# Altium schematic sheet 3_shkb_lite_kbd.SchDoc: =ProjectTitle
size A4; Address1: github.com/4pplet/SHKB; Address2: Licence: CERN-OHL-S; SheetNumber: 3; SheetTotal: 3
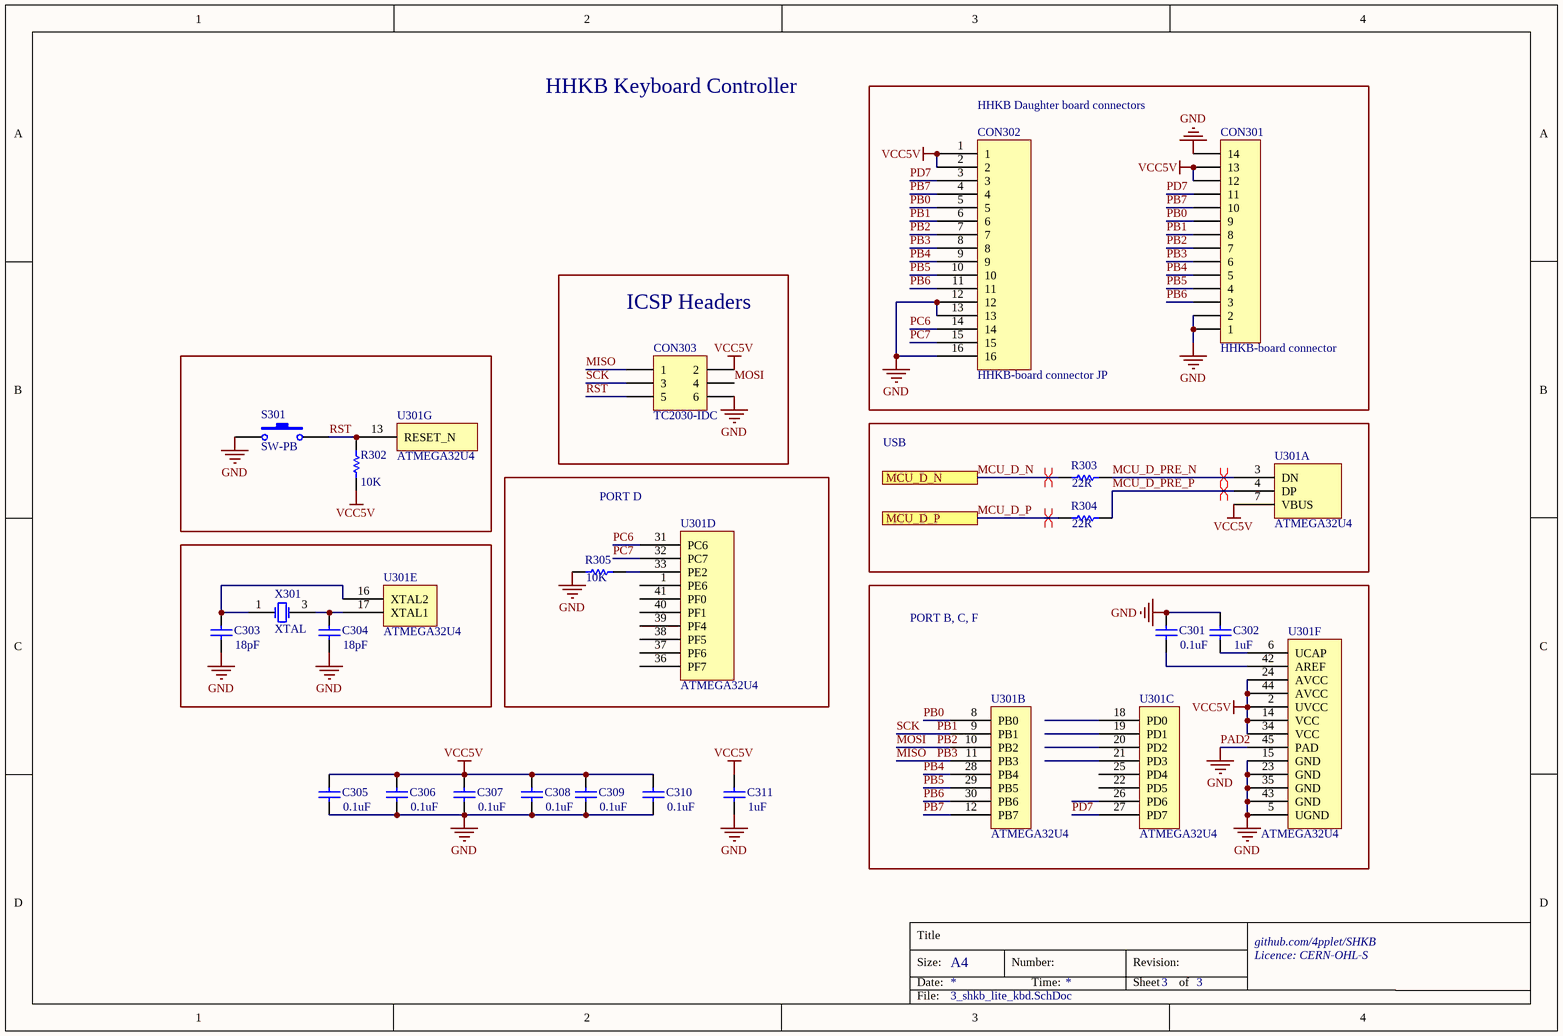
[diagram p0: 3_shkb_lite_kbd.SchDoc]

## Parts
C301  value 0.1uF  [C0603[1608]]
C302  value 1uF  [C0603[1608]]
C303  value 18pF  [C0603[1608]]
C304  value 18pF  [C0603[1608]]
C305  value 0.1uF  [C0603[1608]]
C306  value 0.1uF  [C0603[1608]]
C307  value 0.1uF  [C0603[1608]]
C308  value 0.1uF  [C0603[1608]]
C309  value 0.1uF  [C0603[1608]]
C310  value 0.1uF  [C0603[1608]]
C311  value 1uF  [C0603[1608]]
CON301  HHKB-board connector  [JST S13B-ZR-SM4A-TF(LF)(SN)]
CON302  HHKB-board connector JP  [DF14A-15P-1.25H]  (no BOM)
CON303  TC2030-IDC  [TC2030-IDC-NL]  (no BOM)
R302  value 10K  [R0603[1608]]
R303  value 22R  [R0603[1608]]
R304  value 22R  [R0603[1608]]
R305  value 10K  [R0603[1608]]
S301  SW-PB  [Wurth 431256038736]
U301  ATMEGA32U4  [ATMEGA32U4-COMBO]  (parts A,B,C,D,E,F,G of 7)
X301  XTAL  [XTAL-3225]

## Blocks framed on the sheet
HHKB Daughter board connectors: CON301 CON302
ICSP Headers: CON303
USB: R303 R304 U301
PORT D: R305 U301
PORT B, C, F: C301 C302 U301

## Ports
MCU_D_N, MCU_D_P

## Nets
PAD2: C301.2 C302.2 C303.1 C304.1 C305.1 C306.1 C307.1 C308.1 C309.1 C310.1 C311.1 CON301.1 CON301.2 CON301.14 CON302.12 CON302.13 CON302.16 CON303.6 R305.1 S301.2 S301.3(GND) U301.5(UGND) U301.15(GND) U301.23(GND) U301.35(GND) U301.43(GND) U301.45(PAD) X301.2(GND) X301.4(GND)  [also labelled GND]
VCC5V: C305.2 C306.2 C307.2 C308.2 C309.2 C310.2 C311.2 CON301.12 CON301.13 CON302.1 CON302.2 CON303.2 R302.2 U301.2(UVCC) U301.7(VBUS) U301.14(VCC) U301.24(AVCC) U301.34(VCC) U301.44(AVCC)
MCU_D_N: R303.1 ; port MCU_D_N
MCU_D_P: R304.1 ; port MCU_D_P
MCU_D_PRE_N: R303.2 U301.3(DN)
MCU_D_PRE_P: R304.2 U301.4(DP)
MISO: CON301.6 CON302.8 CON303.1 U301.11(PB3)  [also labelled PB3]
MOSI: CON301.7 CON302.7 CON303.4 U301.10(PB2)  [also labelled PB2]
PB0: CON301.9 CON302.5 U301.8(PB0)
PB1: CON301.8 CON302.6 CON303.3 U301.9(PB1)  [also labelled SCK]
PB4: CON301.5 CON302.9 U301.28(PB4)
PB5: CON301.4 CON302.10 U301.29(PB5)
PB6: CON301.3 CON302.11 U301.30(PB6)
PB7: CON301.10 CON302.4 U301.12(PB7)
PC6: CON302.14 U301.31(PC6)
PC7: CON302.15 U301.32(PC7)
PD7: CON301.11 CON302.3 U301.27(PD7)
RST: CON303.5 R302.1 S301.1 U301.13(RESET_N)
NetC301_1: C301.1 U301.42(AREF)
NetC302_1: C302.1 U301.6(UCAP)
NetC303_2: C303.2 U301.16(XTAL2) X301.1(OSC1)
NetC304_2: C304.2 U301.17(XTAL1) X301.3(OSC2)
NetR305_2: R305.2 U301.33(PE2)

Not connected (* = marked no-connect by the designer): U301 1(PE6) 18(PD0) 19(PD1) 20(PD2) 21(PD3) 22(PD5) 25(PD4) 26(PD6) 36(PF7) 37(PF6) 38(PF5) 39(PF4) 40(PF1) 41(PF0)

## Layout directives
differential pair: MCU_D_N, MCU_D_P, MCU_D_PRE_N, MCU_D_PRE_P

## Notes on the sheet
- HHKB Keyboard Controller
- Title
- Size:
- Date:
- A4
- Number:
- Time:
- Revision:
- Sheet
- of
- File:

## Library data of the parts
C301 C305-C310 = Cap: Capacitor; MRF.Part: CC0603KRX7R9BB104; MFG: KEMET; MFGPN: C0603C104M5RACTU; LCSC MFG: YAGEO; Version: 0603 imperial; JLC: BASIC; LCSC Part #: C14663
C302 C311 = Cap: Capacitor; MRF.Part: CL10A105KB8NNNC; MFG: KEMET; MFGPN: C0603C105K4RACTU; LCSC MFG: Samsung Electro-Mechanics; Version: 0603 imperial; JLC: BASIC; LCSC Part #: C15849
C303 C304 = Cap: Capacitor; MRF.Part: CL10C180JB8NNNC; MFG: KEMET; MFGPN: C0603C180J5GACAUTO; LCSC MFG: Samsung Electro-Mechanics; Version: 0603 imperial; JLC: BASIC; LCSC Part #: C1647
CON301 = Header 14: MFGPN: S13B-ZR-SM4A-TF(LF)(SN); MFG: JST Sales America Inc; LCSC MFG: JST Sales America; JLC: NONE; LCSC Part #: C265326; MRF.Part: S13B-ZR-SM4A-TF(LF)(SN)
CON302 = DF14A-15P-1.25H: MFG: Hirose Electric Co Ltd; MFGPN: DF14A-15P-1.25H(26); LCSC MFG: HRS(Hirose); JLC: NONE; LCSC Part #: C597889; MRF.Part: DF14A-15P-1.25H(26)
CON303 = Header 3X2: Header, 3-Pin, Dual row; JLC: DNP
R302 R305 = Res1: Resistor; MRF.Part: 0603WAF1002T5E; MFG: Vishay Dale; MFGPN: RCA060310K0FKEA; LCSC MFG: Uniroyal Elec; Version: 0603 imperial; JLC: BASIC; LCSC Part #: C25804
R303 R304 = Res1: Resistor; MRF.Part: 0603WAF220JT5E  0603WAF220JT5E; MFG: Vishay Dale; MFGPN: CRCW060322R0FKEAC; LCSC MFG: Uniroyal Elec; Version: 0603 imperial; JLC: BASIC; LCSC Part #: C23345
S301 = SW-PB: Switch; MRF.Part: K2-1102AQ-C4CW-01; MFGPN: 431256038736; MFG: Wurth Electronics Inc; LCSC MFG: Korean Hroparts Elec; LCSC Part #: C127680; JLC: NONE
U301 = ATMEGA32U4: MFG: Microchip Technology; MFGPN: ATMEGA32U4-MUR; LCSC MFG: Microchip Tech; LCSC Part #: C45874; MRF.Part: ATMEGA32U4-MUR; JLC: EXTENDED
X301 = XTAL: Crystal Oscillator; MRF.Part: X322516MLB4SI; LCSC MFG: Yangxing Tech; LCSC Part #: C13738; JLC: BASIC